# Altium schematic sheet Sheet_Gloves.schdoc
size 390 x 464 mm
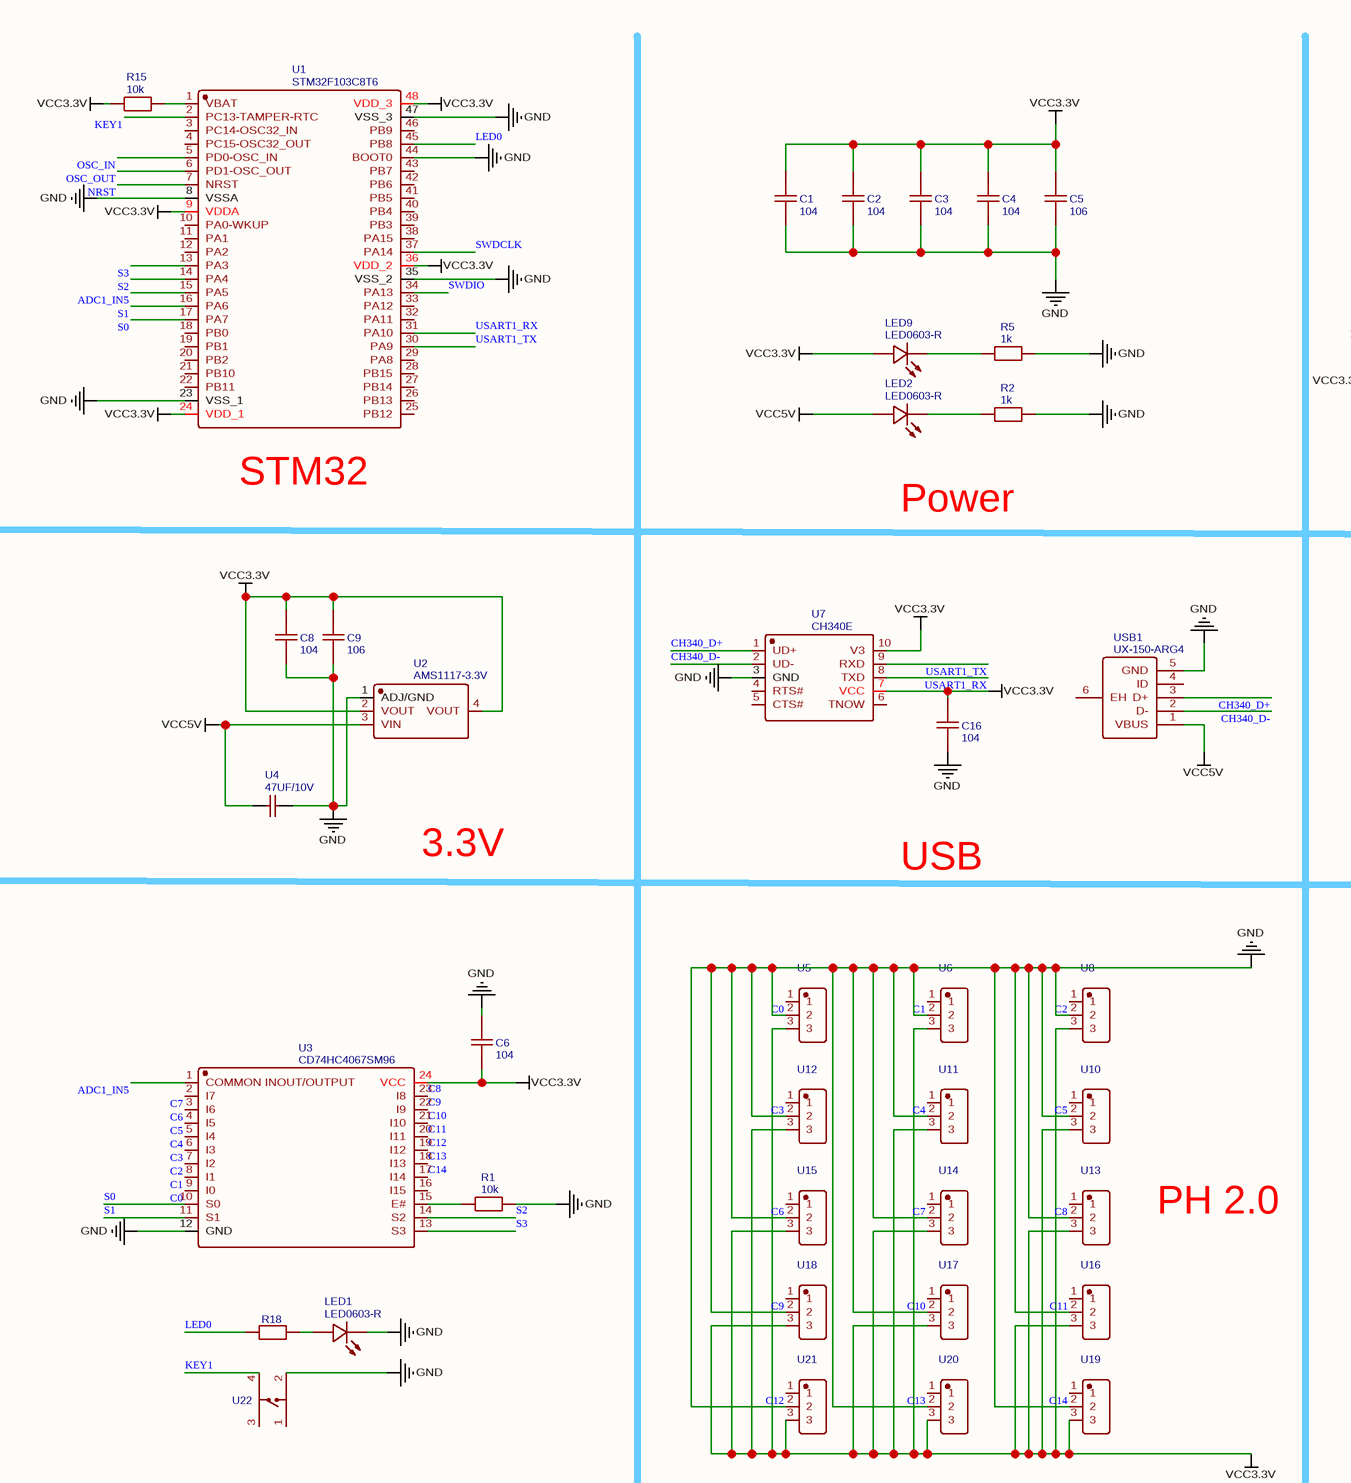
[diagram p0: Sheet_Gloves.schdoc, top left]
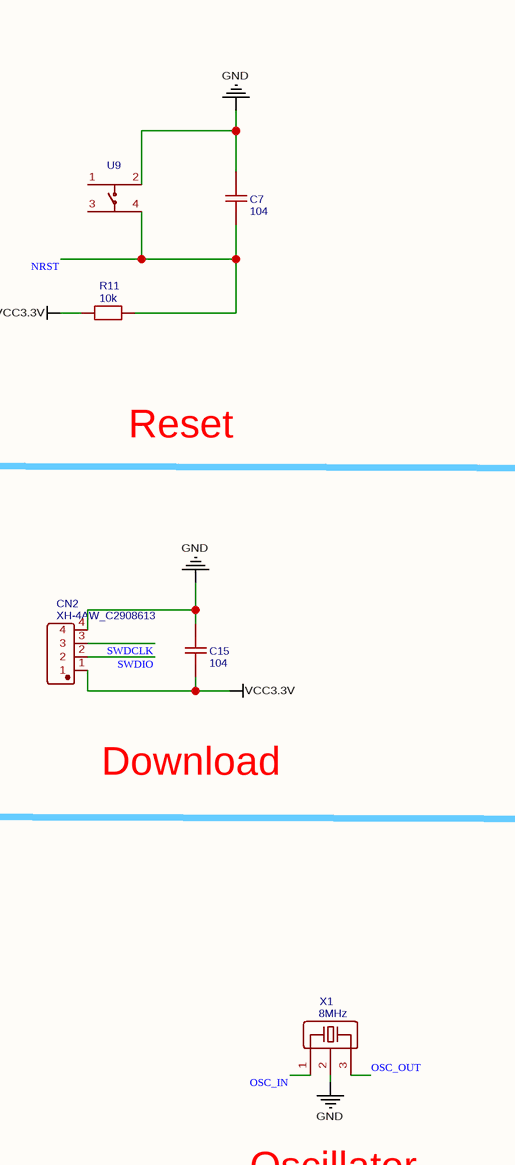
[diagram p1: Sheet_Gloves.schdoc, top right]
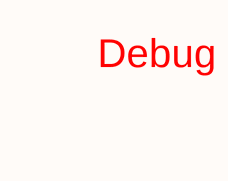
[diagram p2: Sheet_Gloves.schdoc, bottom left]
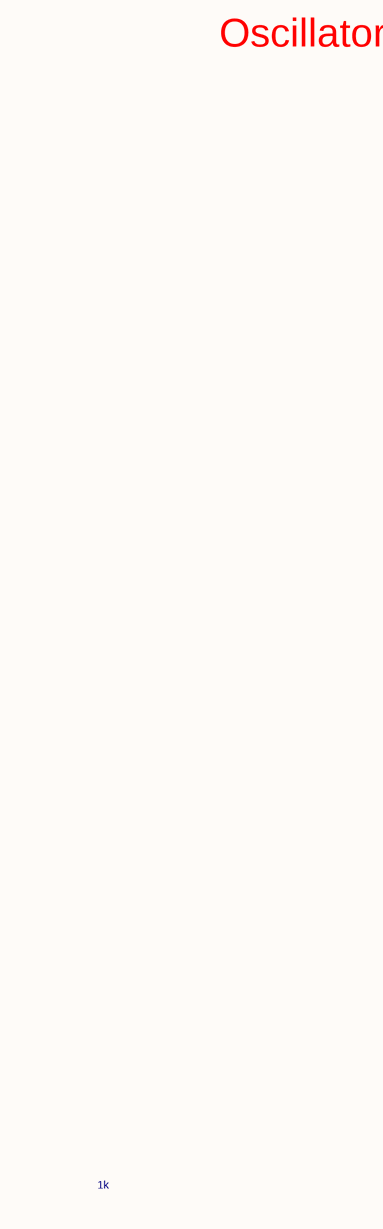
[diagram p3: Sheet_Gloves.schdoc, bottom right]

## Parts
C1  104  [C0603]
C2  104  [C0603]
C3  104  [C0603]
C4  104  [C0603]
C5  106  [C0603]
C6  104  [C0603]
C7  104  [C0603]
C8  104  [C0603]
C9  106  [C0603]
C15  104  [C0603]
C16  104  [C0603]
CN2  XH-4AW_C2908613  [CONN-TH_XH-4AW]
LED1  LED0603-R  [LED0603-R-RD]
LED2  LED0603-R  [LED0603-R-RD]
LED9  LED0603-R  [LED0603-R-RD]
R1  10k  [R0603]
R2  1k  [R0603]
R5  1k  [R0603]
R11  10k  [R0603]
R15  10k  [R0603]
R18  1k  [R0603]
U1  STM32F103C8T6  [LQFP-48_L7.0-W7.0-P0.50-LS9.0-BL]
U2  AMS1117-3.3V  [SOT-223-4_L6.5-W3.5-P2.30-LS7.0-BR]
U3  CD74HC4067SM96  [SSOP-24_L8.1-W5.3-P0.65-LS7.8-BL]
U4  47UF/10V  [C1206]
U5  WAFER-PH2.0-3PZZ-R62  [CONN-TH_4P-P2.00_WAFER-PH2.0-3PZZ-R62]  (value not drawn)
U6  WAFER-PH2.0-3PZZ-R62  [CONN-TH_4P-P2.00_WAFER-PH2.0-3PZZ-R62]  (value not drawn)
U7  CH340E  [MSOP-10_L3.0-W3.0-P0.50-LS5.0-BL]
U8  WAFER-PH2.0-3PZZ-R62  [CONN-TH_4P-P2.00_WAFER-PH2.0-3PZZ-R62]  (value not drawn)
U9  TPS645-5NC60  [SW-SMD_4P-L6.0-W6.0-P4.50-LS9.2]  (value not drawn)
U10  WAFER-PH2.0-3PZZ-R62  [CONN-TH_4P-P2.00_WAFER-PH2.0-3PZZ-R62]  (value not drawn)
U11  WAFER-PH2.0-3PZZ-R62  [CONN-TH_4P-P2.00_WAFER-PH2.0-3PZZ-R62]  (value not drawn)
U12  WAFER-PH2.0-3PZZ-R62  [CONN-TH_4P-P2.00_WAFER-PH2.0-3PZZ-R62]  (value not drawn)
U13  WAFER-PH2.0-3PZZ-R62  [CONN-TH_4P-P2.00_WAFER-PH2.0-3PZZ-R62]  (value not drawn)
U14  WAFER-PH2.0-3PZZ-R62  [CONN-TH_4P-P2.00_WAFER-PH2.0-3PZZ-R62]  (value not drawn)
U15  WAFER-PH2.0-3PZZ-R62  [CONN-TH_4P-P2.00_WAFER-PH2.0-3PZZ-R62]  (value not drawn)
U16  WAFER-PH2.0-3PZZ-R62  [CONN-TH_4P-P2.00_WAFER-PH2.0-3PZZ-R62]  (value not drawn)
U17  WAFER-PH2.0-3PZZ-R62  [CONN-TH_4P-P2.00_WAFER-PH2.0-3PZZ-R62]  (value not drawn)
U18  WAFER-PH2.0-3PZZ-R62  [CONN-TH_4P-P2.00_WAFER-PH2.0-3PZZ-R62]  (value not drawn)
U19  WAFER-PH2.0-3PZZ-R62  [CONN-TH_4P-P2.00_WAFER-PH2.0-3PZZ-R62]  (value not drawn)
U20  WAFER-PH2.0-3PZZ-R62  [CONN-TH_4P-P2.00_WAFER-PH2.0-3PZZ-R62]  (value not drawn)
U21  WAFER-PH2.0-3PZZ-R62  [CONN-TH_4P-P2.00_WAFER-PH2.0-3PZZ-R62]  (value not drawn)
U22  TPS645-5NC60  [SW-SMD_4P-L6.0-W6.0-P4.50-LS9.2]  (value not drawn)
USB1  UX-150-ARG4  [MICRO-USB-TH_UX-150-ARG4]
X1  8MHz  [OSC-SMD_3P-L3.2-W1.3-P1.2-L]

## Nets
GND: C1.1 C2.1 C3.1 C4.1 C5.1 C6.2 C7.2 C8.1 C9.1 C15.2 C16.1 CN2.4 LED1.2(K) R1.2 R2.2 R5.2 U1.8(VSSA) U1.23(VSS_1) U1.35(VSS_2) U1.44(BOOT0) U1.47(VSS_3) U2.1(ADJ/GND) U3.12(GND) U4.2 U5.2 U6.2 U7.3(GND) U8.2 U9.2 U10.2 U11.2 U12.2 U13.2 U14.2 U15.2 U16.2 U17.2 U18.2 U19.2 U20.2 U21.2 U22.2 USB1.5(GND) X1.2
VCC3.3V: C1.2 C2.2 C3.2 C4.2 C5.2 C6.1 C8.2 C9.2 C15.1 C16.2 CN2.1 LED9.1(A) R11.1 R15.2 U1.9(VDDA) U1.24(VDD_1) U1.36(VDD_2) U1.48(VDD_3) U2.2(VOUT) U2.4(VOUT) U3.24(VCC) U5.3 U6.3 U7.7(VCC) U7.10(V3) U8.3 U10.3 U11.3 U12.3 U13.3 U14.3 U15.3 U16.3 U17.3 U18.3 U19.3 U20.3 U21.3
VCC5V: LED2.1(A) U2.3(VIN) U4.1 USB1.1(VBUS)
ADC1_IN5: U1.15(PA5) U3.1(COMMON_INOUT/OUTPUT)
C0: U3.9(I0) U5.1
C1: U3.8(I1) U6.1
C2: U3.7(I2) U8.1
C3: U3.6(I3) U12.1
C4: U3.5(I4) U11.1
C5: U3.4(I5) U10.1
C6: U3.3(I6) U15.1
C7: U3.2(I7) U14.1
C8: U3.23(I8) U13.1
C9: U3.22(I9) U18.1
C10: U3.21(I10) U17.1
C11: U3.20(I11) U16.1
C12: U3.19(I12) U21.1
C13: U3.18(I13) U20.1
C14: U3.17(I14) U19.1
CH340_D+: U7.1(UD+) USB1.3(D+)
CH340_D-: U7.2(UD-) USB1.2(D-)
KEY1: U1.2(PC13-TAMPER-RTC) U22.4
LED0: R18.1 U1.45(PB8)
NRST: C7.1 R11.2 U1.7(NRST) U9.4
OSC_IN: U1.5(PD0-OSC_IN) X1.1
OSC_OUT: U1.6(PD1-OSC_OUT) X1.3
S0: U1.17(PA7) U3.10(S0)
S1: U1.16(PA6) U3.11(S1)
S2: U1.14(PA4) U3.14(S2)
S3: U1.13(PA3) U3.13(S3)
SWDCLK: CN2.3 U1.37(PA14)
SWDIO: CN2.2 U1.34(PA13)
USART1_RX: U1.31(PA10) U7.8(TXD)
USART1_TX: U1.30(PA9) U7.9(RXD)
NetLED1_1: LED1.1(A) R18.2
NetLED2_2: LED2.2(K) R2.1
NetLED9_2: LED9.2(K) R5.1
NetR1_1: R1.1 U3.15(E#)
NetR15_1: R15.1 U1.1(VBAT)

Not connected (* = marked no-connect by the designer): U1 3(PC14-OSC32_IN) 4(PC15-OSC32_OUT) 10(PA0-WKUP) 11(PA1) 12(PA2) 18(PB0) 19(PB1) 20(PB2) 21(PB10) 22(PB11) 25(PB12) 26(PB13) 27(PB14) 28(PB15) 29(PA8) 32(PA11) 33(PA12) 38(PA15) 39(PB3) 40(PB4) 41(PB5) 42(PB6) 43(PB7) 46(PB9); U3 16(I15); U7 4(RTS#) 5(CTS#) 6(TNOW); U9 1 3; U22 1 3; USB1 4(ID) 6(EH)

## Notes on the sheet
- (near U1) STM32
- Power
- Reset
- Download
- 3.3V
- USB
- PH 2.0
- Oscillator
- Debug

## Library data of the parts
C1-C4 C6-C8 C15 C16 = 104: nameAlias: Value(F); Contributor: LCEDA_Lib; spicePre: C; spiceSymbolName: C_0603_US
C5 C9 = 106: nameAlias: Value(F); Contributor: LCEDA_Lib; spicePre: C; spiceSymbolName: C_0603_US
CN2 = XH-4AW_C2908613: Manufacturer: HCTL(华灿天禄); Manufacturer Part: XH-4AW; Contributor: LCSC; Supplier: LCSC; Supplier Part: C2908613; JLCPCB Part Class: Extended Part; spicePre: C; spiceSymbolName: XH-4AW_C2908613
LED1 LED2 LED9 = LED0603-R: Manufacturer: null; Contributor: LCSC; Supplier: LCSC; Supplier Part: C9900005326; Manufacturer Part: LED0603-R; JLCPCB Part Class: Extended Part; spicePre: L; spiceSymbolName: LED0603-R
R1 R11 R15 = 10k: nameAlias: Value(Ω); Contributor: LCEDA_Lib; spicePre: R; spiceSymbolName: R_0603_EU
R2 R5 R18 = 1k: nameAlias: Value(Ω); Contributor: LCEDA_Lib; spicePre: R; spiceSymbolName: R_0603_EU
U1 = STM32F103C8T6: Manufacturer: ST(意法半导体); timeStamp: 1455028086; Supplier: LCSC; Manufacturer Part: STM32F103C8T6; Supplier Part: C8734; JLCPCB Part Class: Extended Part; spicePre: U; spiceSymbolName: STM32F103C8T6
U2 = AMS1117-3.3V: Manufacturer: WPMtek(维攀微); Contributor: LCSC; Supplier: LCSC; Supplier Part: C2688239; Manufacturer Part: AMS1117-3.3V; JLCPCB Part Class: Extended Part; spicePre: U; spiceSymbolName: AMS1117-3.3V
U3 = CD74HC4067SM96: Manufacturer: TI(德州仪器); Supplier: LCSC; Manufacturer Part: CD74HC4067SM96; Supplier Part: C98457; JLCPCB Part Class: Extended Part; spicePre: U; spiceSymbolName: CD74HC4067SM96
U4 = 47UF/10V: Manufacturer: null; Contributor: LCSC; Supplier: LCSC; Supplier Part: C9900008467; Manufacturer Part: 47uF/10V; link: https://atta.szlcsc.comnull; JLCPCB Part Class: Extended Part; spicePre: U; spiceSymbolName: 47UF/10V_C9900008467
U5 U6 U8 U10-U21 = WAFER-PH2.0-3PZZ-R62: Manufacturer: XUNPU(讯普); Contributor: lcsc; Supplier: LCSC; Supplier Part: C22390428; Manufacturer Part: WAFER-PH2.0-3PZZ-R62; JLCPCB Part Class: Extended Part; spicePre: U; spiceSymbolName: WAFER-PH2.0-3PZZ-R62
U7 = CH340E: Manufacturer: WCH(南京沁恒); Supplier: LCSC; Manufacturer Part: CH340E; Supplier Part: C99652; JLCPCB Part Class: Extended Part; spicePre: U; spiceSymbolName: CH340E
U9 U22 = TPS645-5NC60: Manufacturer: ROCPU Switches(台普); Contributor: lcsc; Supplier: LCSC; Supplier Part: C19191552; Manufacturer Part: TPS645-5NC60; JLCPCB Part Class: Extended Part; spicePre: U; spiceSymbolName: TPS645-5NC60
USB1 = UX-150-ARG4: Manufacturer: XUNPU(讯普); Contributor: LCSC; Supplier: LCSC; Supplier Part: C720612; Manufacturer Part: UX-150-ARG4; JLCPCB Part Class: Extended Part; spicePre: U; spiceSymbolName: UX-150-ARG4
X1 = 8MHz: Manufacturer Part: CSTCE8M00G52-R0; Manufacturer: muRata(村田); nameAlias: Frequency; Supplier: LCSC; Supplier Part: C22549; JLCPCB Part Class: Extended Part; spicePre: X; spiceSymbolName: CSTCE8M00G52-R0